# EAGLE design AnalogOutputModule_8ch (EAGLE 7.7.0)
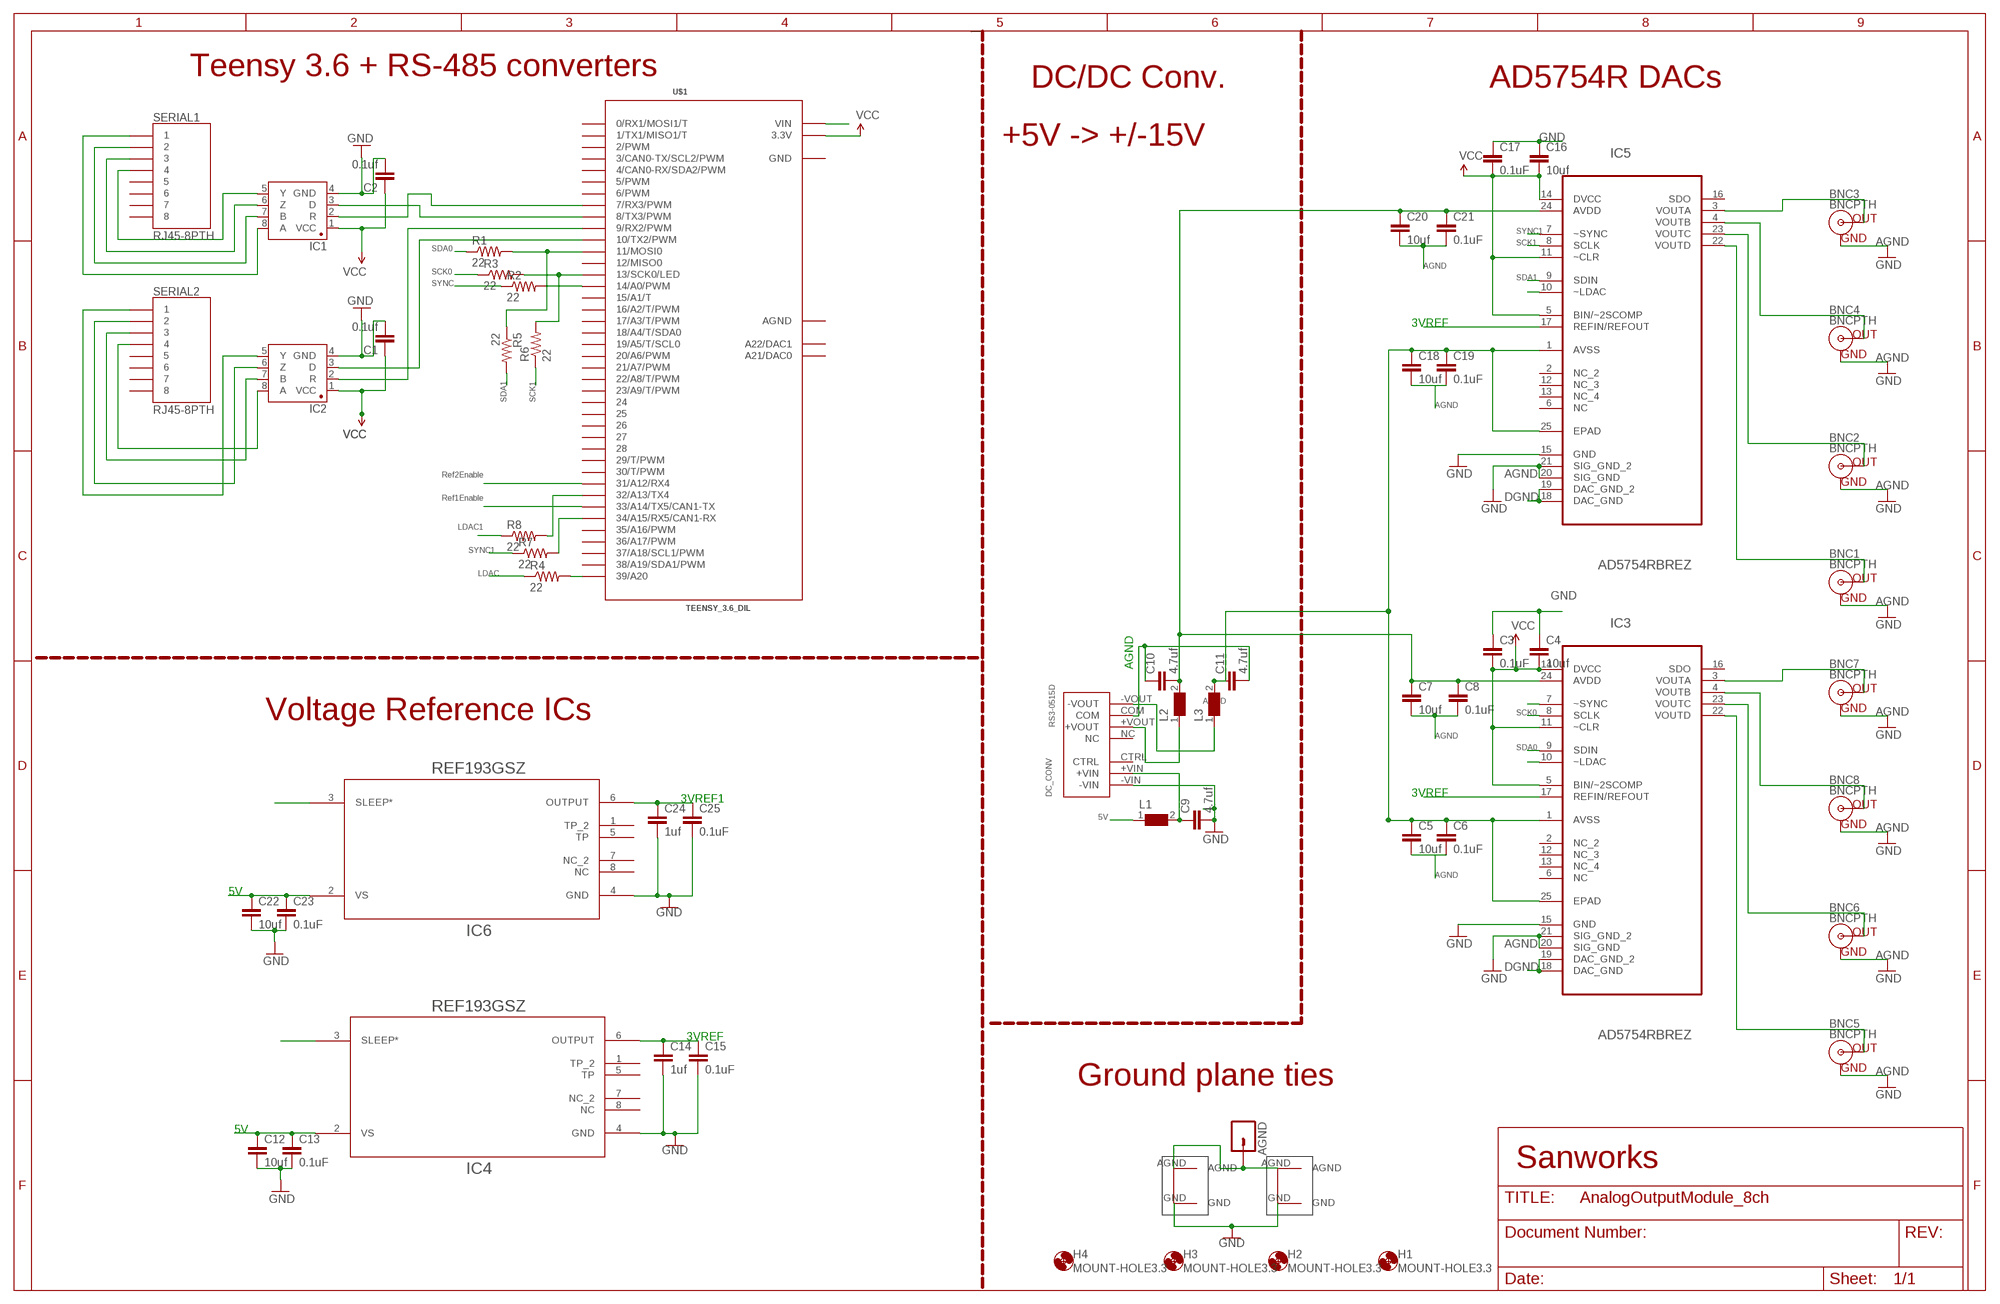
[diagram p0: schematic, sheet 1]

## Parts
AGND  M01PTH  [1X01]
BNC1  BNCPTH  [BNC]
BNC2  BNCPTH  [BNC]
BNC3  BNCPTH  [BNC]
BNC4  BNCPTH  [BNC]
BNC5  BNCPTH  [BNC]
BNC6  BNCPTH  [BNC]
BNC7  BNCPTH  [BNC]
BNC8  BNCPTH  [BNC]
C1  0.1uf  CAP1206  [1206@1]
C2  0.1uf  CAP1206  [1206@1]
C3  0.1uF  1.0UF-0805-25V-10%  [0805]
C4  10uf  CAP1206  [1206@1]
C5  10uf  CAP1206  [1206@1]
C6  0.1uF  1.0UF-0805-25V-10%  [0805]
C7  10uf  CAP1206  [1206@1]
C8  0.1uF  1.0UF-0805-25V-10%  [0805]
C9  4.7uf  CAP1206  [1206@1]
C10  4.7uf  CAP1206  [1206@1]
C11  4.7uf  CAP1206  [1206@1]
C12  10uf  CAP1206  [1206@1]
C13  0.1uF  1.0UF-0805-25V-10%  [0805]
C14  1uf  CAP1206  [1206@1]
C15  0.1uF  1.0UF-0805-25V-10%  [0805]
C16  10uf  CAP1206  [1206@1]
C17  0.1uF  1.0UF-0805-25V-10%  [0805]
C18  10uf  CAP1206  [1206@1]
C19  0.1uF  1.0UF-0805-25V-10%  [0805]
C20  10uf  CAP1206  [1206@1]
C21  0.1uF  1.0UF-0805-25V-10%  [0805]
C22  10uf  CAP1206  [1206@1]
C23  0.1uF  1.0UF-0805-25V-10%  [0805]
C24  1uf  CAP1206  [1206@1]
C25  0.1uF  1.0UF-0805-25V-10%  [0805]
DC_CONV  RS3-0515D  [RS3-0515D]
H1  MOUNT-HOLE3.3  [3,3]
H2  MOUNT-HOLE3.3  [3,3]
H3  MOUNT-HOLE3.3  [3,3]
H4  MOUNT-HOLE3.3  [3,3]
IC1  SN65HVD31DR  [SO08]
IC2  SN65HVD31DR  [SO08]
IC3  AD5754RBREZ  [SOP65P640X120-25N]
IC4  REF193GSZ  [R_8]
IC5  AD5754RBREZ  [SOP65P640X120-25N]
IC6  REF193GSZ  [R_8]
L1  WE-CBF-742792118_1206  [1206]
L2  WE-CBF-742792118_1206  [1206]
L3  WE-CBF-742792118_1206  [1206]
R1  22  RESISTOR1206  [1206]
R2  22  RESISTOR1206  [1206]
R3  22  RESISTOR1206  [1206]
R4  22  RESISTOR1206  [1206]
R5  22  RESISTOR1206  [1206]
R6  22  RESISTOR1206  [1206]
R7  22  RESISTOR1206  [1206]
R8  22  RESISTOR1206  [1206]
SERIAL1  RJ45-8PTH  [RJ45-8]
SERIAL2  RJ45-8PTH  [RJ45-8]
U$1  TEENSY_3.6_DIL  [TEENSY_3.6_DIL]
U$2  GNDPLANESHRT  [GNDPLANESHRT]
U$6  GNDPLANESHRT  [GNDPLANESHRT]

## Nets
3VREF: C14.1 C15.1 IC3.17(REFIN/REFOUT) IC4.6(OUTPUT)
3VREF1: C24.1 C25.1 IC5.17(REFIN/REFOUT) IC6.6(OUTPUT)
5V: C3.2 C4.2 C12.1 C13.1 C16.2 C17.2 C22.1 C23.1 IC3.5(BIN/~2SCOMP) IC3.11(~CLR) IC3.14(DVCC) IC4.2(VS) IC5.5(BIN/~2SCOMP) IC5.11(~CLR) IC5.14(DVCC) IC6.2(VS) L1.1 U$1.VIN ; supply symbol labelled VCC
AGND: AGND.1 BNC1.GND BNC2.GND BNC3.GND BNC4.GND BNC5.GND BNC6.GND BNC7.GND BNC8.GND C5.2 C6.2 C7.2 C8.2 C10.1 C11.2 C18.2 C19.2 C20.2 C21.2 DC_CONV.COM IC3.18(DAC_GND) IC3.19(DAC_GND_2) IC3.20(SIG_GND) IC3.21(SIG_GND_2) IC5.18(DAC_GND) IC5.19(DAC_GND_2) IC5.20(SIG_GND) IC5.21(SIG_GND_2) U$2.AGND U$6.AGND ; supply symbol labelled GND
GND: C1.2 C2.2 C3.1 C4.1 C9.2 C12.2 C13.2 C14.2 C15.2 C16.1 C17.1 C22.2 C23.2 C24.2 C25.2 DC_CONV.-VIN IC1.4(GND) IC2.4(GND) IC3.15(GND) IC4.4(GND) IC5.15(GND) IC6.4(GND) U$2.GND U$6.GND
LDAC: IC3.10(~LDAC) R4.1
LDAC1: IC5.10(~LDAC) R8.1
N$1: IC1.3(D) U$1.8(8/TX3/PWM)
N$2: IC1.2(R) U$1.7(7/RX3/PWM)
N$3: IC2.8(A) SERIAL2.4
N$4: IC2.7(B) SERIAL2.3
N$5: IC2.6(Z) SERIAL2.2
N$6: IC2.5(Y) SERIAL2.1
N$7: IC2.3(D) U$1.10(10/TX2/PWM)
N$8: IC2.2(R) U$1.9(9/RX2/PWM)
N$9: BNC7.S(OUT) IC3.3(VOUTA)
N$10: BNC8.S(OUT) IC3.4(VOUTB)
N$11: BNC6.S(OUT) IC3.23(VOUTC)
N$12: BNC5.S(OUT) IC3.22(VOUTD)
N$13: R1.2 R5.1 U$1.11(11/MOSI0)
N$14: R3.2 R6.2 U$1.13(13/SCK0/LED)
N$15: DC_CONV.-VOUT L3.1
N$16: DC_CONV.+VOUT L2.1
N$17: R2.2 U$1.14/A0(14/A0/PWM)
N$18: R4.2 U$1.39/A20
N$19: IC1.8(A) SERIAL1.1
N$21: IC1.7(B) SERIAL1.2
N$22: IC1.6(Z) SERIAL1.3
N$23: IC1.5(Y) SERIAL1.4
N$24: BNC3.S(OUT) IC5.3(VOUTA)
N$25: BNC4.S(OUT) IC5.4(VOUTB)
N$26: BNC2.S(OUT) IC5.23(VOUTC)
N$27: BNC1.S(OUT) IC5.22(VOUTD)
N$28: R7.2 U$1.34/A15(34/A15/RX5/CAN1-RX)
N$30: R8.2 U$1.32/A13(32/A13/TX4)
N$41: C9.1 DC_CONV.+VIN L1.2
REF1ENABLE: IC4.3(SLEEP*) U$1.33/A14(33/A14/TX5/CAN1-TX)
REF2ENABLE: IC6.3(SLEEP*) U$1.31/A12(31/A12/RX4)
SCK0: IC3.8(SCLK) R3.1
SCK1: IC5.8(SCLK) R6.1
SDA0: IC3.9(SDIN) R1.1
SDA1: IC5.9(SDIN) R5.2
SYNC: IC3.7(~SYNC) R2.1
SYNC1: IC5.7(~SYNC) R7.1
VCC: C1.1 C2.1 IC1.1(VCC) IC2.1(VCC) U$1.3.3V U$1.3.3V3(3.3V)
VDD1: C7.1 C8.1 C10.2 C20.1 C21.1 IC3.24(AVDD) IC5.24(AVDD) L2.2
VSS1: C5.1 C6.1 C11.1 C18.1 C19.1 IC3.1(AVSS) IC3.25(EPAD) IC5.1(AVSS) IC5.25(EPAD) L3.2
Unconnected: DC_CONV.CTRL DC_CONV.NC IC3.2(NC_2) IC3.6(NC) IC3.12(NC_3) IC3.13(NC_4) IC3.16(SDO) IC4.1(TP_2) IC4.5(TP) IC4.7(NC_2) IC4.8(NC) IC5.2(NC_2) IC5.6(NC) IC5.12(NC_3) IC5.13(NC_4) IC5.16(SDO) IC6.1(TP_2) IC6.5(TP) IC6.7(NC_2) IC6.8(NC) SERIAL1.5 SERIAL1.6 SERIAL1.7 SERIAL1.8 SERIAL2.5 SERIAL2.6 SERIAL2.7 SERIAL2.8 U$1.0(0/RX1/MOSI1/T) U$1.1(1/TX1/MISO1/T) U$1.2(2/PWM) U$1.3(3/CAN0-TX/SCL2/PWM) U$1.4(4/CAN0-RX/SDA2/PWM) U$1.5(5/PWM) U$1.6(6/PWM) U$1.12(12/MISO0) U$1.15/A1(15/A1/T) U$1.16/A2(16/A2/T/PWM) U$1.17/A3(17/A3/T/PWM) U$1.18/A4(18/A4/T/SDA0) U$1.19/A5(19/A5/T/SCL0) U$1.20/A6(20/A6/PWM) U$1.21/A7(21/A7/PWM) U$1.22/A8(22/A8/T/PWM) U$1.23/A9(23/A9/T/PWM) U$1.24 U$1.25 U$1.26 U$1.27 U$1.28 U$1.29(29/T/PWM) U$1.30(30/T/PWM) U$1.35/A16(35/A16/PWM) U$1.36/A17(36/A17/PWM) U$1.37/A18(37/A18/SCL1/PWM) U$1.38/A19(38/A19/SDA1/PWM) U$1.A21(A21/DAC0) U$1.A22(A22/DAC1)

## Notes on the sheet
- Teensy 3.6 + RS-485 converters
- DC/DC Conv. | AD5754R DACs
- GND
- +5V -> +/-15V
- SYNC1
- SCK1 | AGND
- SDA0
- AGND
- SCK0
- SDA1
- SYNC
- 3VREF
- AGND
- SDA1 | SCK1
- AGND
- Ref2Enable
- AGND
- AGND
- Ref1Enable
- DGND
- LDAC1
- SYNC1
- LDAC
- GND
- AGND
- AGND
- AGND
- SCK0 | AGND
- Voltage Reference ICs
- AGND
- SDA0
- 3VREF
- 3VREF1
- 5V
- AGND
- AGND
- 5V
- AGND
- AGND
- DGND
- 3VREF
- AGND
- Ground plane ties
- 5V
- Sanworks

## Power pins joined to a net without a drawn wire
AGND: U$1.AGND
GND: U$1.GND U$1.GND1(GND)

## Library data of the parts
AGND = SparkFun-Connectors:M01: Header 1 Standard 1-pin 0.1" header. Use with straight break away headers (SKU : PRT-00116), right angle break away headers (PRT-00553), swiss pins (PRT-00743), machine pins (PRT-00117), and female headers (PRT-00115).
BNC1-BNC8 = SparkFun-Connectors:BNC: BNC Right Angle Connector Mouser Part# 5227161 SparkFun Products: BNC Connector - Right Angle <https://www.sparkfun.com/products/10550>; PROD_ID: LPA-12729; SF_ID: PRT-10550
C1 C2 C4 C5 C7 C9-C12 C14 C16 C18 C20 C22 C24 = SparkFun-Capacitors:CAP: Capacitor Standard 0603 ceramic capacitor, and 0.1" leaded capacitor.
C3 C6 C8 C13 C15 C17 C19 C21 C23 C25 = SparkFun-Capacitors:1.0UF: 1µF ceramic capacitors A capacitor is a passive two-terminal electrical component used to store electrical energy temporarily in an electric field.; PROD_ID: CAP-08064; VALUE: 1.0uF
DC_CONV = JoshParts10:RS3-0515D
H1-H4 = holes:MOUNT-HOLE: MOUNTING HOLE with drill center marker
IC1 IC2 = Joshparts4:SN65HVD31DR: A placeholder for generic narrow & wide SOIC8 foorptints - used on the DIP adapter board.
IC3 IC5 = Analog Devices_By_element14_Batch_1:AD5754RBREZ: DAC; MPN: AD5754RBREZ; OC_FARNELL: 1786050; OC_NEWARK: 51P3755; PACKAGE: TSSOP-24; SUPPLIER: Analog Devices
IC4 IC6 = REF193:REF193GSZ; MANUFACTURER_PART_NUMBER: REF193GSZ; VENDOR: Vendor
L1-L3 = WE-CBF:WE-CBF: SMD EMI Suppression Ferrite Beads WE-CBF - Excellent anti-EMI properties - Low DC-restistance - Impedances till 3000 ohms - Rated current up to 6 A -- Reliable Ni-Sn electrodes -- Perfect as data lined filter and for uncoupling of distribution voltage; MPN: 742792118; OC_FARNELL: 1800374; OC_NEWARK: 78R5648; PACKAGE: IND-1206; SUPPLIER: Wuerth Elektronik
R1-R8 = SparkFun-Resistors:RESISTOR: Resistor Basic schematic elements and footprints for 0603, 1206, and PTH resistors.
SERIAL1 SERIAL2 = SparkFun:RJ45-8: RJ45 Jack Simple RJ45, 8-pin connection - connector for common Cat5, Cat5e, and Cat6 Ethernet cables. Footprint not yet proven in production. Connector sku is PRT-00643; Breakout PCB sku is BOB-00716.
U$1 = Teensy_3_and_LC_Series_Boards_v1.4:TEENSY_3.6_DIL: Teensy 3.6 DIL Package
U$2 U$6 = Joshparts2:GNDPLANESHRT

## Net classes
0 default: width 0.203 mm

## Board
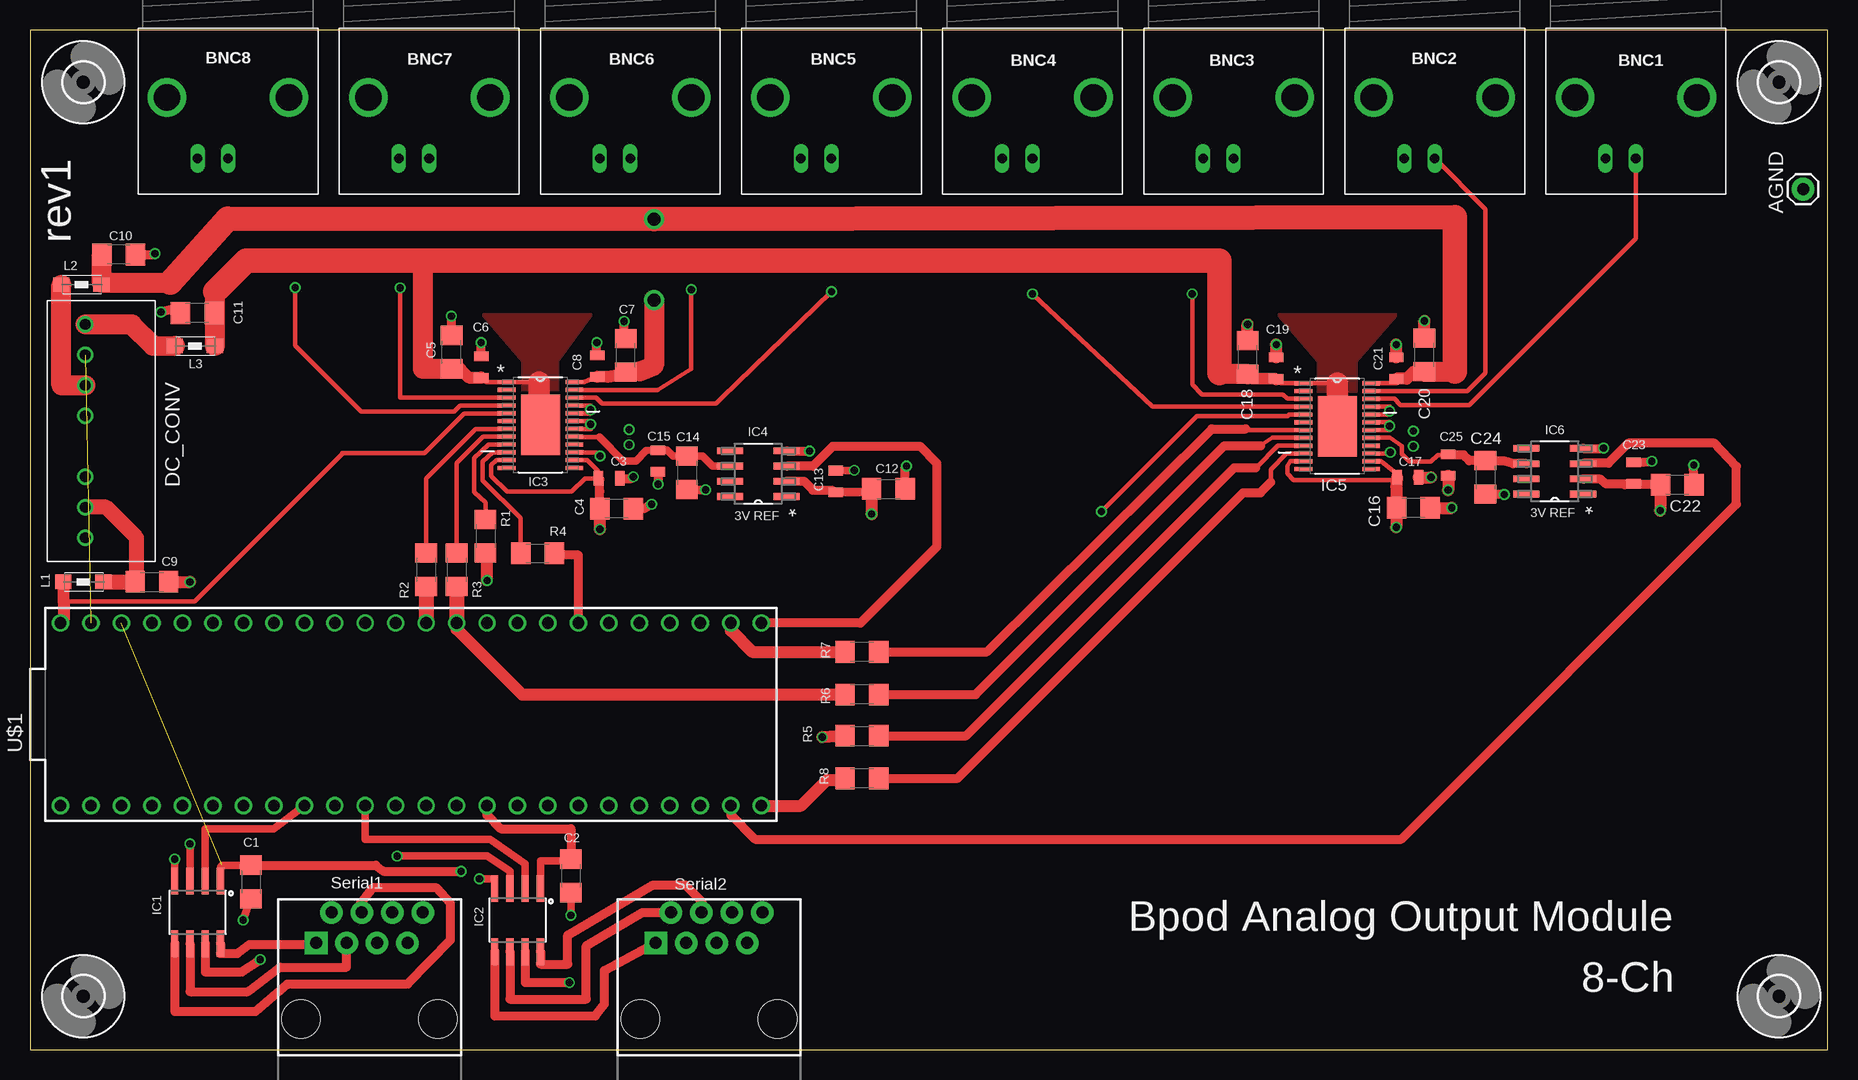
[diagram p1: board, top side]
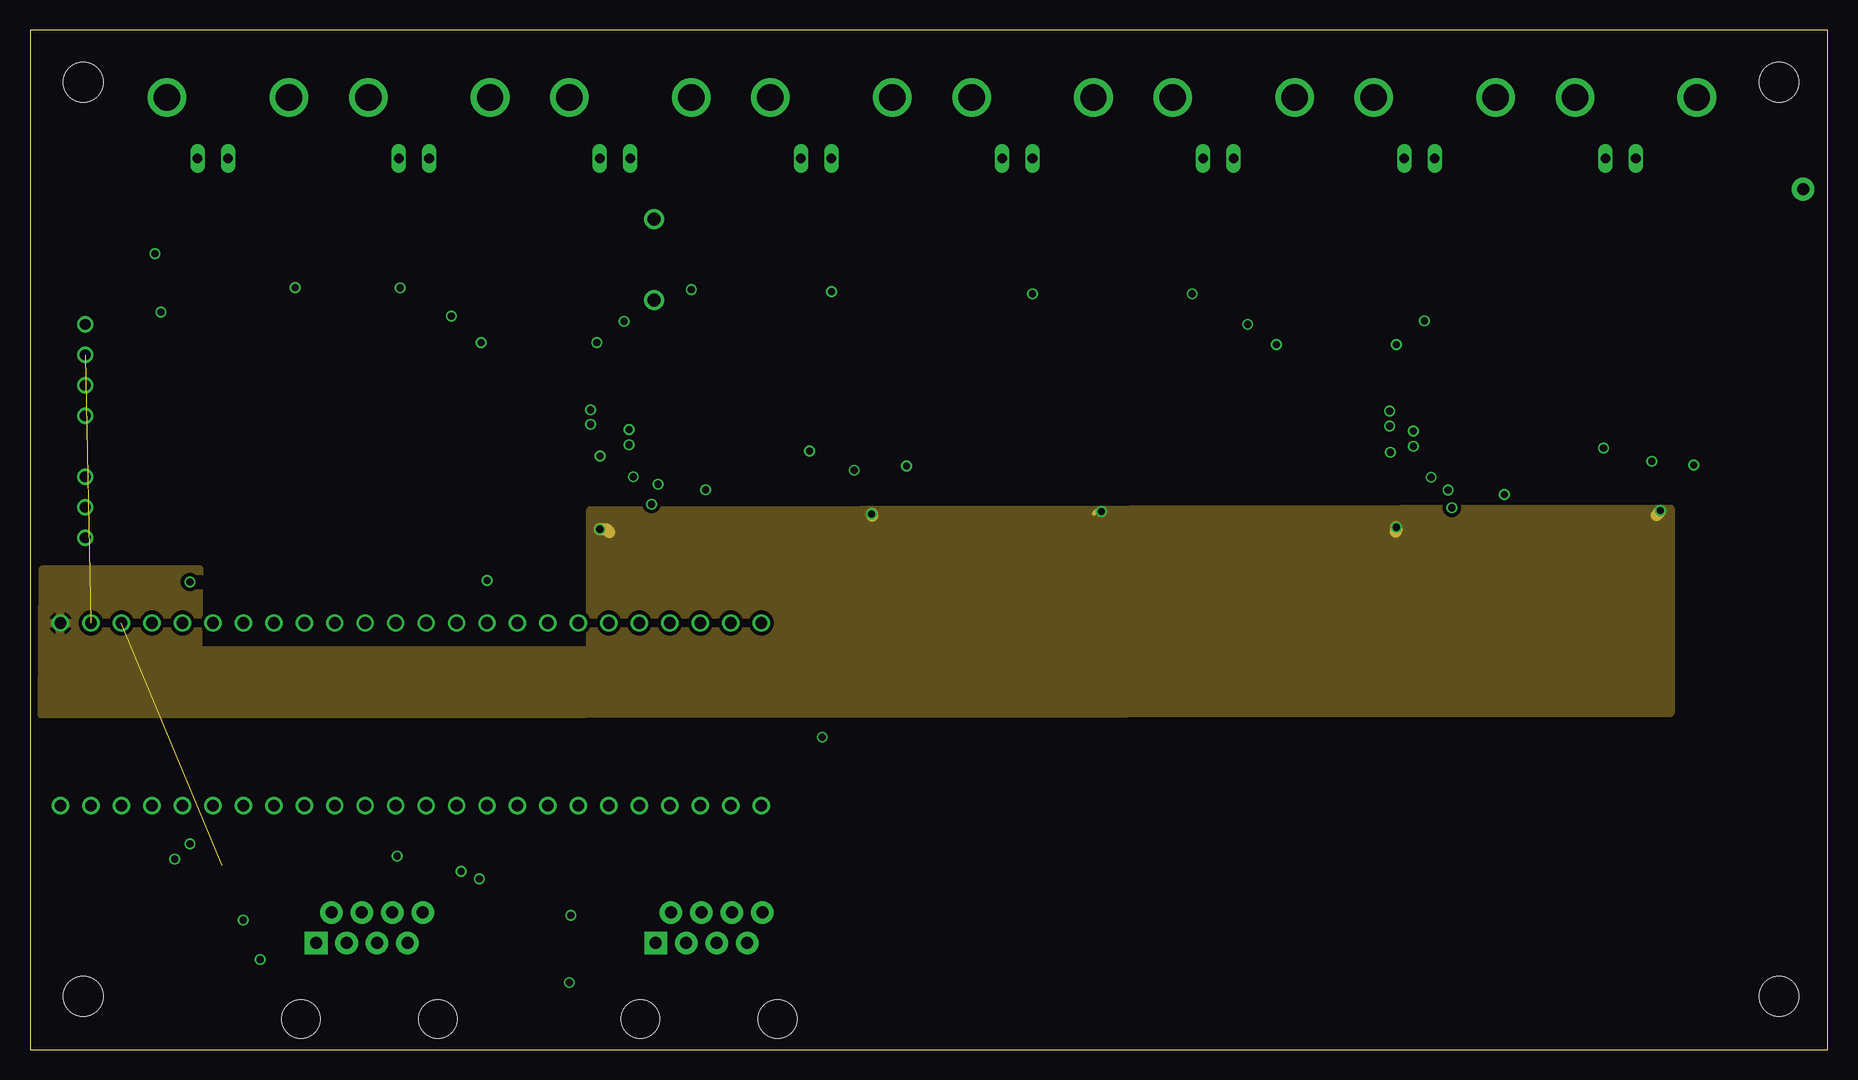
[diagram p2: board, inner layer Route2]
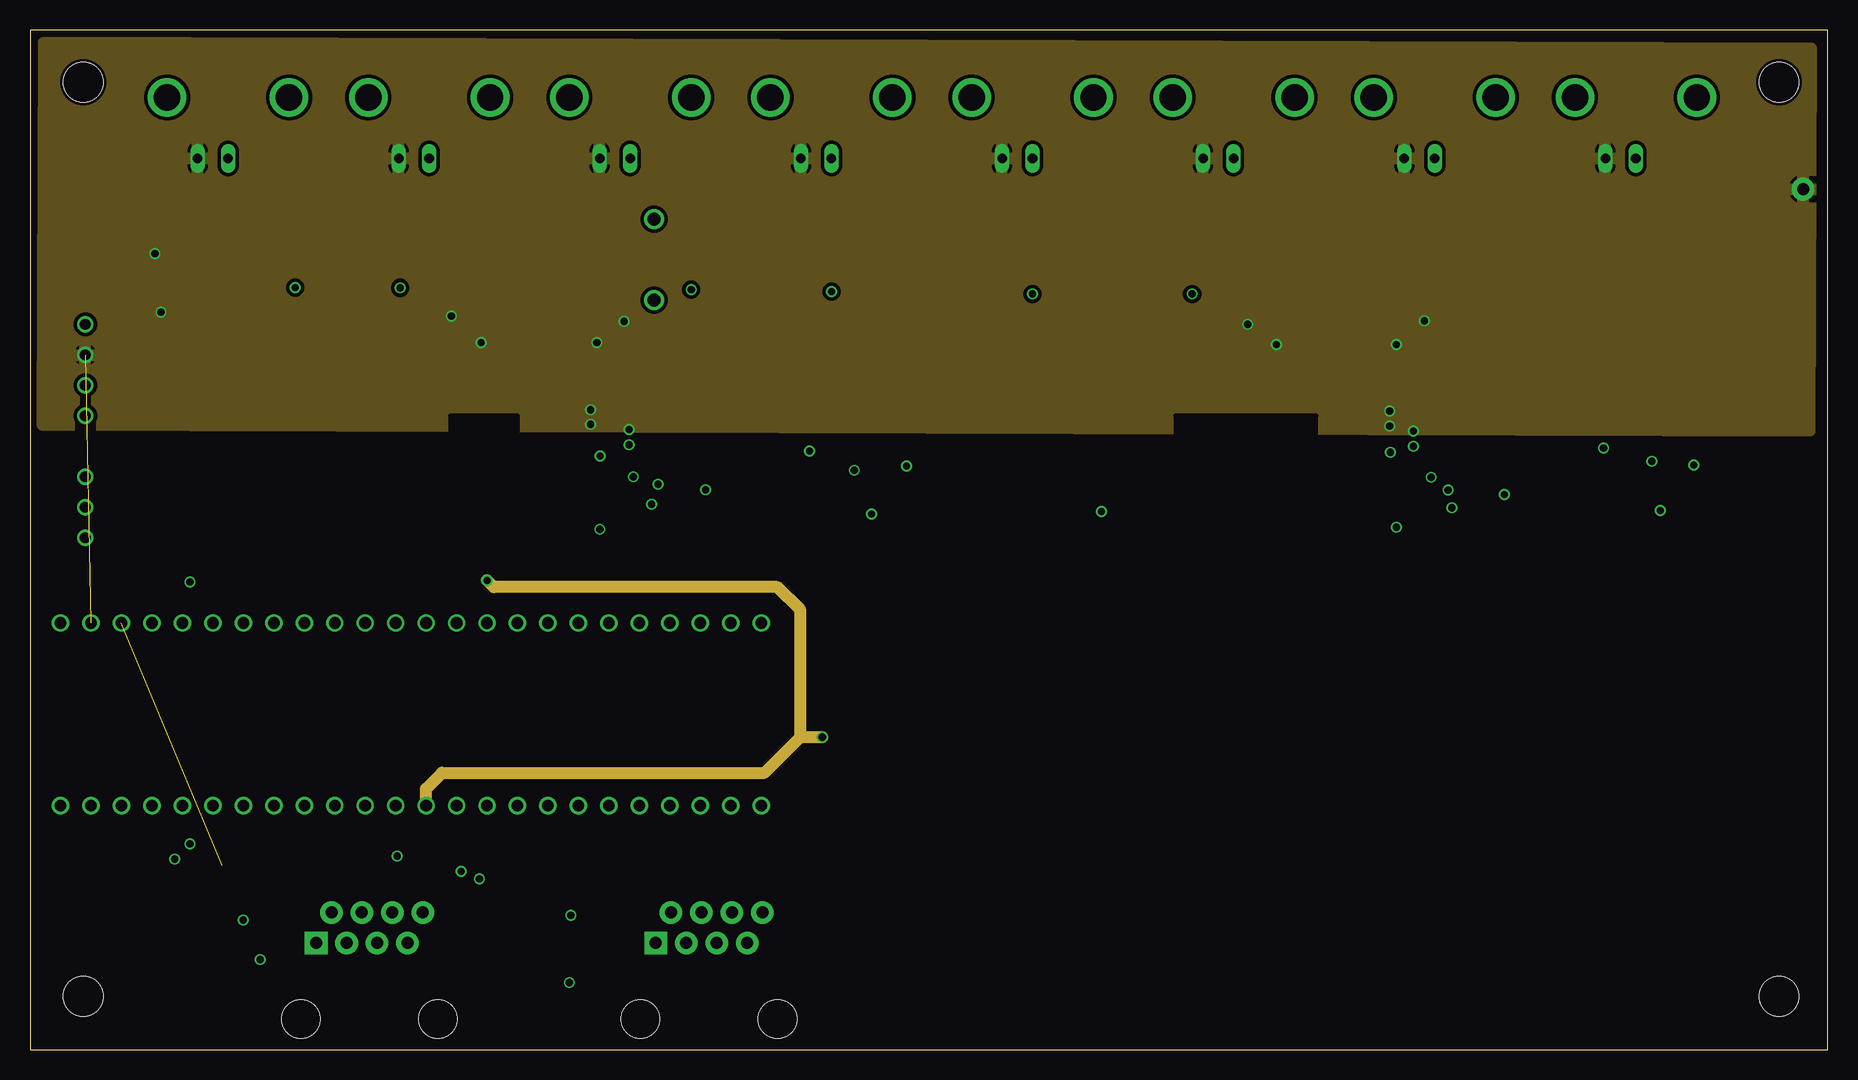
[diagram p3: board, inner layer Route15]
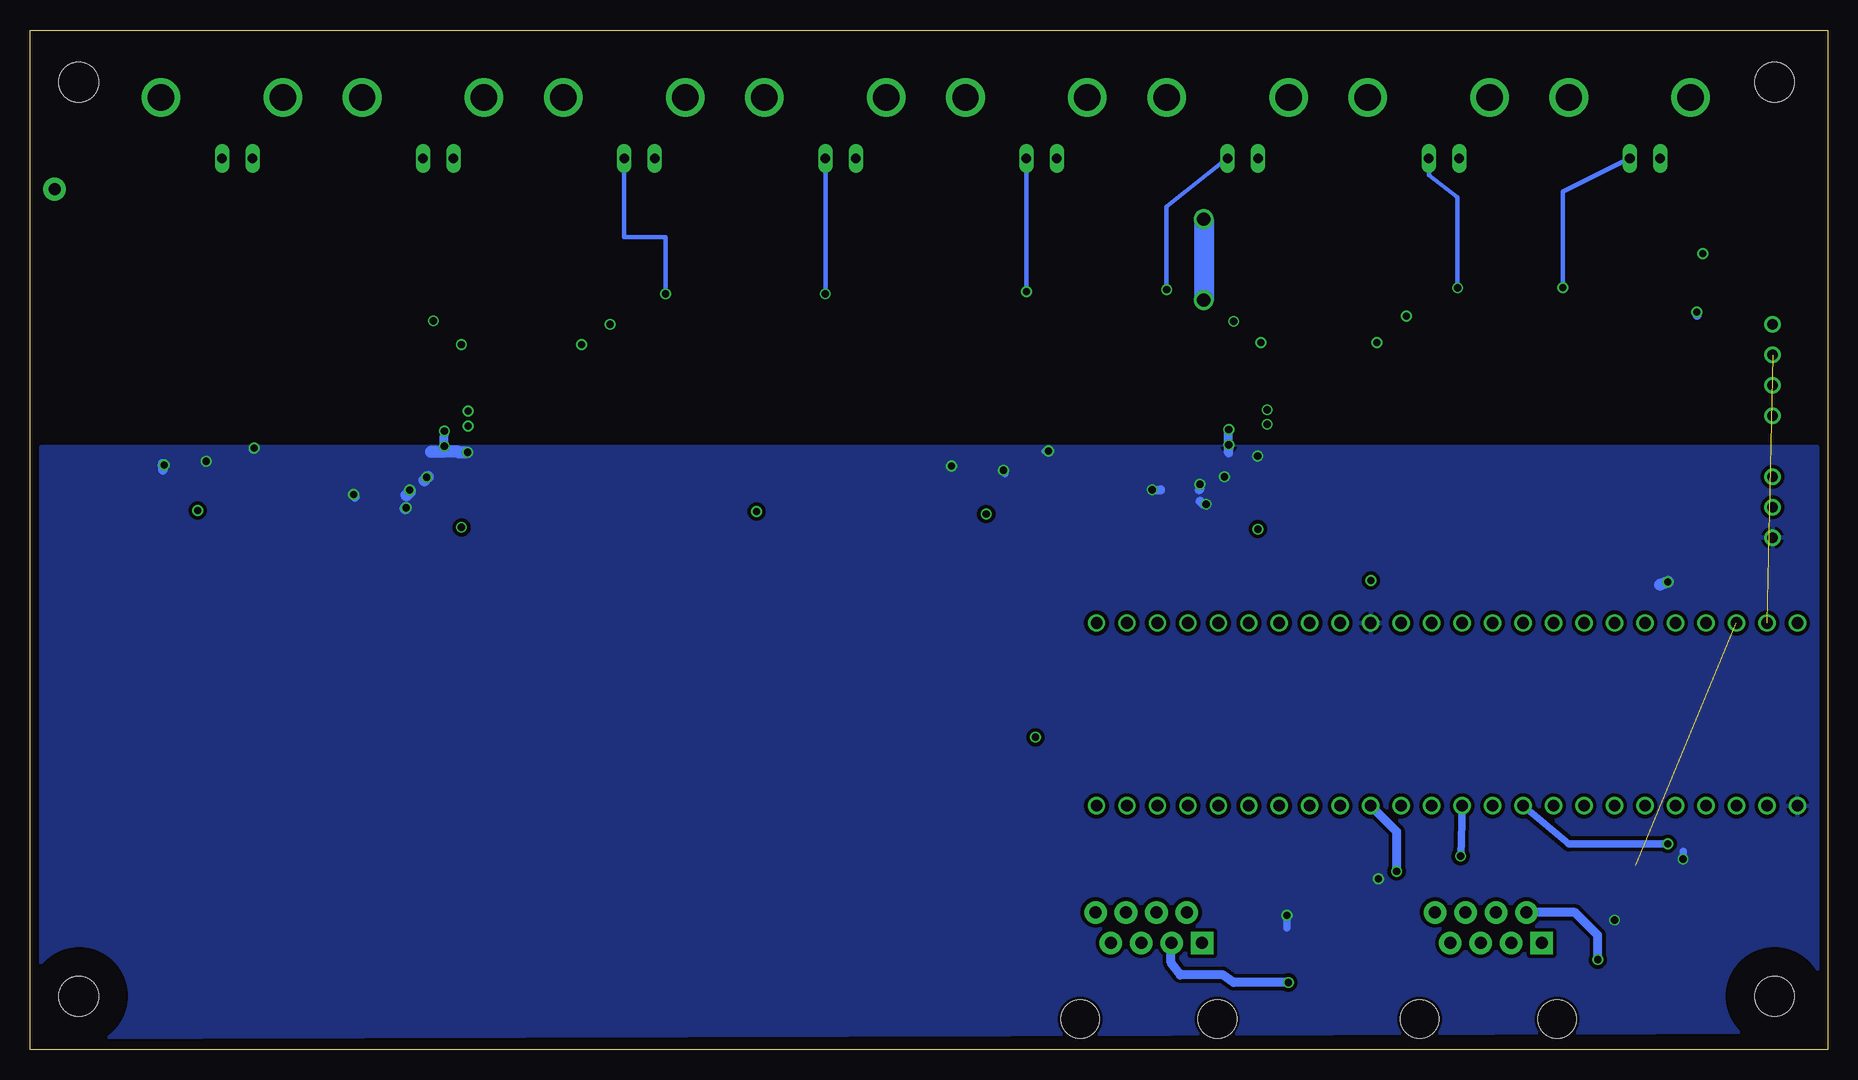
[diagram p4: board, bottom side, seen from below]

Size 149.86 x 85 mm. Coordinates in mm from the lower left corner, seen from the top.
Outline: 0,0 149.86,0 149.86,85 0,85 0,0
Copper layers (1*2*15*16): Top 0.035mm / dielectric 0.2mm / Route2 0.0175mm / dielectric 0.3mm / Route15 0.0175mm / dielectric 0.2mm / Bottom 0.035mm
Design rules "SeeedStudio_4layer_DRU_no_angle_20140221 *": minimum track width 8mil, minimum drill 12mil, track to track 12mil, track to pad 12mil, pad to pad 12mil, via to via 12mil, smd to smd 0mil, copper to edge 10mil, drill to drill 8mil, minimum pad ring 6mil, minimum via ring 4mil, stop-mask expansion 4mil, vias tented up to drill 25mil, thermal gap 10mil
tRestrict: area 3.8,37.6 to 11.4,40.6; area 3.6,33.8 to 14.5,37.3

### Footprints (pad centres in the part's own frame; a part is rotated, then mirrored left to right if it is on the bottom)
1X01 = drill 1.016 pad 1.88: 1 0,0
BNC = drill 2.2: 3 -5.08,5.08; 4 5.08,5.08 | drill 0.8 long: GND -2.54,0; S 0,0
1206@1 = smd 1.6 x 1.8: 1 -1.4,0; 2 1.4,0
0805 = smd 0.8 x 1.2: 1 -0.9,0; 2 0.9,0
RS3-0515D = drill 0.9: +VIN 7.62,5.08; +VOUT 17.78,5.08; -VIN 5.08,5.08; -VOUT 22.86,5.08; COM 20.32,5.08; CTRL 10.16,5.08; NC 15.24,5.08
3,3 = hole 3.3: 0,0
SO08 = smd 0.61 x 2.21: 1 -1.905,-2.616; 2 -0.635,-2.616; 3 0.635,-2.616; 4 1.905,-2.616; 5 1.905,2.616; 6 0.635,2.616; 7 -0.635,2.616; 8 -1.905,2.616
SOP65P640X120-25N = smd 1.473 x 0.356: 1 -2.819,3.581; 2 -2.819,2.921; 3 -2.819,2.286; 4 -2.819,1.626; 5 -2.819,0.965; 6 -2.819,0.33; 7 -2.819,-0.33; 8 -2.819,-0.965; 9 -2.819,-1.626; 10 -2.819,-2.286; 11 -2.819,-2.921; 12 -2.819,-3.581; 13 2.819,-3.581; 14 2.819,-2.921; 15 2.819,-2.286; 16 2.819,-1.626; 17 2.819,-0.965; 18 2.819,-0.33; 19 2.819,0.33; 20 2.819,0.965; 21 2.819,1.626; 22 2.819,2.286; 23 2.819,2.921; 24 2.819,3.581 | smd 3.251 x 5.029: 25 0,0
R_8 = smd 2.184 x 0.559: 1 -2.362,1.905; 2 -2.362,0.635; 3 -2.362,-0.635; 4 -2.362,-1.905; 5 2.362,-1.905; 6 2.362,-0.635; 7 2.362,0.635; 8 2.362,1.905
1206 = smd 1.35 x 1.2: 1 -1.675,0; 2 1.675,0
1206' = smd 1.6 x 1.8: 1 -1.4,0; 2 1.4,0
RJ45-8 = drill 1 pad 1.88 square: 1 -4.445,6.35 | drill 1 pad 1.88: 2 -3.175,8.89; 3 -1.905,6.35; 4 -0.635,8.89; 5 0.635,6.35; 6 1.905,8.89; 7 3.175,6.35; 8 4.445,8.89 | hole 3.2: -5.715,0; 5.715,0
TEENSY_3.6_DIL = drill 0.965: 0 -7.62,25.4; 1 -7.62,22.86; 2 -7.62,20.32; 3 -7.62,17.78; 3.3V 7.62,22.86; 3.3V3 -7.62,-7.62; 4 -7.62,15.24; 5 -7.62,12.7; 6 -7.62,10.16; 7 -7.62,7.62; 8 -7.62,5.08; 9 -7.62,2.54; 10 -7.62,0; 11 -7.62,-2.54; 12 -7.62,-5.08; 13 7.62,-5.08; 14/A0 7.62,-2.54; 15/A1 7.62,0; 16/A2 7.62,2.54; 17/A3 7.62,5.08; 18/A4 7.62,7.62; 19/A5 7.62,10.16; 20/A6 7.62,12.7; 21/A7 7.62,15.24; 22/A8 7.62,17.78; 23/A9 7.62,20.32; 24 -7.62,-10.16; 25 -7.62,-12.7; 26 -7.62,-15.24; 27 -7.62,-17.78; 28 -7.62,-20.32; 29 -7.62,-22.86; 30 -7.62,-25.4; 31/A12 -7.62,-27.94; 32/A13 -7.62,-30.48; 33/A14 7.62,-30.48; 34/A15 7.62,-27.94; 35/A16 7.62,-25.4; 36/A17 7.62,-22.86; 37/A18 7.62,-20.32; 38/A19 7.62,-17.78; 39/A20 7.62,-15.24; A21 7.62,-12.7; A22 7.62,-10.16; AGND 7.62,25.4; GND -7.62,27.94; GND1 7.62,-7.62; VIN 7.62,27.94
GNDPLANESHRT = drill 0.6: AGND -1.27,0; GND 0,0

### Placement (x,y rotation side)
AGND  147.8,71.73 0 top
BNC1  133.86,74.3 0 top
BNC2  117.09,74.3 0 top
BNC3  100.33,74.3 0 top
BNC4  83.57,74.3 0 top
BNC5  66.8,74.3 0 top
BNC6  50.04,74.3 0 top
BNC7  33.27,74.3 0 top
BNC8  16.51,74.3 0 top
C1  18.41,13.97 270 top
C2  45.09,14.48 270 top
C3  48.26,47.62 180 top
C4  48.9,45.09 180 top
C5  35.15,58.15 90 top
C6  37.62,56.91 90 top
C7  49.66,57.88 90 top
C8  47.27,56.99 90 top
C9  10.16,38.99 0 top
C10  7.4,66.27 180 top
C11  13.94,61.39 180 top
C12  71.55,46.74 0 top
C13  67.16,47.37 90 top
C14  54.76,48.08 270 top
C15  52.35,49.07 270 top
C16  115.32,45.16 180 top
C17  114.86,47.7 180 top
C18  101.5,57.71 90 top
C19  103.89,56.79 90 top
C20  116.23,57.91 90 top
C21  113.89,56.79 90 top
C22  137.31,47.09 0 top
C23  133.68,48.06 90 top
C24  121.31,47.7 270 top
C25  118.21,48.72 270 top
DC_CONV  9.69,37.59 90 top
H1  145.8,4.45 0 top
H2  4.45,4.45 0 top
H3  4.45,80.64 0 top
H4  145.8,80.64 0 top
IC1  13.97,11.43 180 top
IC2  40.64,10.79 180 top
IC3  42.55,52.07 0 top
IC4  60.71,48.01 180 top
IC5  108.97,51.97 0 top
IC6  127.1,48.21 180 top
L1  4.45,38.99 0 top
L2  4.29,63.77 0 top
L3  13.74,58.65 0 top
R1  22  [1206']  37.97,42.8 270 top
R2  22  [1206']  33.02,40.01 270 top
R3  22  [1206']  35.56,40.01 270 top
R4  22  [1206']  42.32,41.38 0 top
R5  22  [1206']  69.34,26.16 0 top
R6  22  [1206']  69.34,29.59 180 top
R7  22  [1206']  69.34,33.15 180 top
R8  22  [1206']  69.34,22.61 180 top
SERIAL1  28.3,2.54 0 top
SERIAL2  56.6,2.54 0 top
U$1  30.48,27.94 90 top
U$2  115.32,50.29 270 top
U$6  49.94,50.42 270 top

### Tracks (layer width: path | path; a pad name or v marks a point on that pad's centre or on a via)
3VREF
  Top 0.381: 47.47,51.08 45.41,51.08 IC3.17
  Top 0.635: IC4.6 56.9,48.64 56.06,49.48 C14.1 53.59,49.48 53.11,49.96 52.39,49.96 C15.1 51.37,49.92 50.52,49.07 49.45,49.07 47.47,51.08
3VREF1
  Top 0.381: IC5.17 113.33,51 114.35,50.29 114.35,49.63 114.96,49.02 116.79,49.02 117.35,49.58 118.2,49.58 C25.1
  Top 0.762: IC6.6 123.62,48.84 122.89,49.07 121.34,49.07 C24.1 119.96,49.1 119.48,49.58 118.22,49.58 C25.1
5V  (via drill 0.6)
  Top 0.381: IC3.14 46.43,49.15 47.4,48.18 47.4,47.64 C3.2 | 47.16,47.37 C3.2 | IC3.5 36.2,53.03 32.89,49.73 26.04,49.73 26.04,49.66 13.72,37.34 2.79,37.34 | IC3.11 38.91,49.15 38.46,48.74 38.46,47.83 39.78,46.51 45.16,46.51 46.28,47.62 C3.2 | 47.47,46.51 47.49,46.53 | IC5.14 112.6,49.05 113.89,48.01 113.89,47.16 C17.2 113.81,47.5 105.31,47.5 104.8,48.01 104.8,48.67 105.08,49.05 IC5.11 | IC5.5 104.95,52.93 104.85,52.83 97.28,52.83 v89.31,44.86
  Top 0.635: 63.08,47.38 IC4.2
  Top 0.762: C4.2 47.49,46.53 47.49,47.54 C3.2 | 63.08,47.38 64.5,47.38 65.25,46.63 66.84,46.63 C13.1 69.94,46.52 C12.1 | 70.15,44.6 70.16,44.6 | IC6.2 129.49,47.55 130.91,47.55 131.35,47.16 132.32,47.16 C23.1 132.91,47.09 C22.1
  Top 1.016: C17.2 113.92,46.78 C16.2 113.92,43.71 v113.89,43.54 | L1.1 2.79,38.97 2.79,37.34 2.79,35.81 U$1.VIN | C12.1 70.15,44.71 | C4.2 v47.49,43.39 v47.5,43.38 | 70.15,44.6 70.15,44.71 | 70.15,44.71 v70.16,44.65 | C22.1 135.91,45.08 v135.89,44.93
  Route2 0.381: v89.31,44.86 88.85,44.86 88.7,44.7
  Route2 1.016: v70.16,44.65 70.21,44.5 | v47.5,43.38 48.06,43.38 48.31,43.13 | v135.89,44.93 135.64,44.6 135.59,44.55 | v113.89,43.54 113.89,43.23 113.84,43.18
  pour Route2: 1.12,40.03 14.07,40.03 13.97,33.27 46.74,33.27 46.74,44.96 136.73,45.09 136.73,28.07 1.02,27.94
AGND  (via drill 0.6)  (1 unrouted)
  Top 0.381: v46.74,53.34 46.74,53.03 IC3.20 46.71,53.03 46.71,53.7 IC3.21 | IC3.19 46.74,52.4 | IC3.18 46.76,51.74 46.76,52.4 46.74,52.4 | IC5.21 113.33,53.59 v113.33,53.24 113.33,52.93 IC5.20 | IC5.18 113.33,51.64 v113.33,51.97 113.33,52.3 IC5.19 | 46.74,52.4 v46.74,52.12
  Top 0.762: C5.2 35.15,60.36 v35.13,61.14 | C6.2 37.62,58.9 v37.59,58.93 | C8.2 47.24,57.97 v47.24,58.93 | C7.2 49.53,59.05 v49.53,60.71 | C10.1 10.16,66.27 v10.41,66.34 | C11.2 11.61,61.65 v10.92,61.47
  Top 1.016: C18.2 v101.5,60.45 | C19.2 v103.89,58.78 | C20.2 v116.23,60.76 | C21.2 v113.89,58.78
  Route15 0.381: v113.33,51.97 113.39,51.97 | v46.74,52.12 46.79,52.12
  Bottom 0.381: v113.33,53.24 113.33,52.93
  Bottom 0.762: v10.92,61.47 10.92,61.21
  pour Route15: 1.14,83.92 1.04,52.1 148.36,51.61 148.46,83.44
GND  (via drill 0.6)
  Top 0.381: IC3.15 47.22,49.78 v47.52,49.48 | IC5.15 113.28,49.68 v113.39,49.78
  Top 0.508: 64.95,49.91 v64.97,49.89
  Top 0.635: C1.2 v17.78,10.79 | IC1.4 v12.06,15.88 | C2.2 v45.09,11.18 | v37.47,14.22 38.73,14.22 IC2.4 | C13.2 v68.71,48.28
  Top 0.762: C3.1 50.16,47.62 v50.29,47.75 | C4.1 51.18,45.09 v51.82,45.47 | IC4.4 64.95,49.91 | C14.2 55.04,46.68 v56.31,46.66 | C15.2 v52.35,47.12 | C23.2 134.47,48.97 135.18,49.02 v135.18,49.05 | C22.2 138.66,48.64 v138.68,48.72 | IC6.4 131.09,50.11 v131.17,50.14 | C24.2 122.66,46.3 v122.89,46.28 | C12.2 72.95,48.54 v73.05,48.64
  Top 1.016: C9.2 v13.34,38.99 | C16.1 v118.52,45.16 | C25.2 v118.21,46.63 | C17.1 v116.79,47.7
  Bottom 0.381: v47.52,49.48 47.8,49.48 47.83,49.45
  Bottom 0.508: v64.97,49.89 65.3,49.89 65.33,49.86
  Bottom 0.635: v12.06,15.88 12.06,16.51 | v45.09,11.18 45.09,10.16 | v73.05,48.64 73.03,48.49 | v68.71,48.28 68.61,48.01
  Bottom 0.762: v51.82,45.47 52.07,45.47 52.32,45.72 | 49.96,51.71 49.96,49.73 49.94,50.31 U$6.GND | v56.31,46.66 55.63,46.69 | v52.35,47.12 52.35,46.71 52.4,46.66 | v135.18,49.05 135.18,49.02 135.23,48.97 | v138.68,48.72 138.79,48.31 138.84,48.87 | v131.17,50.14 131.27,50.04 131.12,50.14 | v122.89,46.28 122.73,46.08 122.78,46.02 | 115.37,49.89 115.32,51.61
  Bottom 1.016: v13.34,38.99 13.97,38.73 | v118.52,45.16 118.57,45.11 | v118.21,46.63 118.21,46.48 118.47,46.23 | 116.69,47.75 v116.79,47.7 116.99,47.45 | v113.39,49.78 114.15,49.78 114.15,49.84 115.37,49.84 | 116.43,49.84 115.37,49.84 | 115.37,49.84 115.37,49.89
  pour Bottom: 0.89,50.22 0.89,1.47 148.92,1.04 148.92,50.22
LDAC
  Top 0.381: R4.1 40.92,44.33 37.74,47.45 37.74,49.02 38.56,49.78 IC3.10
LDAC1
  Top 0.381: 103.43,47.3 103.43,48.36 104.75,49.68 IC5.10
  Top 0.762: R8.1 77.32,22.61 101.14,46.43 102.56,46.43 103.43,47.3
N$1  (via drill 0.6)
  Top 0.635: IC1.3 v13.34,17.14
  Bottom 0.635: v13.34,17.14 21.59,17.14 U$1.8
N$2
  Top 0.635: IC1.2 14.61,18.41 20.32,18.41 U$1.7
N$3
  Top 0.762: SERIAL2.4 56.01,11.47 56.01,12.32 54.61,13.72 51.94,13.72 44.83,9.53 44.83,7.11 42.55,7.11 IC2.8
N$4  (via drill 0.6)
  Top 0.762: IC2.7 41.27,5.59 v44.96,5.59
  Bottom 0.762: v44.96,5.59 49.53,5.59 50.42,6.22 53.98,6.22 54.74,7.24 54.74,8.85 SERIAL2.3
N$5
  Top 0.762: IC2.6 40.01,4.19 46.35,4.19 46.35,8.64 51.05,11.43 SERIAL2.2
N$6
  Top 0.762: IC2.5 38.73,2.79 47.12,2.79 47.88,3.81 47.88,6.6 SERIAL2.1 52.07,8.8
N$7  (via drill 0.6)
  Top 0.635: IC2.3 40.01,14.86 38.1,16.13 v30.61,16.13
  Bottom 0.635: v30.61,16.13 U$1.10
N$8
  Top 0.635: IC2.2 41.27,15.49 38.35,17.53 27.94,17.53 U$1.9
N$9  (via drill 0.6)
  Top 0.381: IC3.3 30.86,54.36 v30.86,63.5
  Bottom 0.381: v30.86,63.5 30.86,71.04 33.27,72.9 BNC7.S
N$10  (via drill 0.6)
  Top 0.381: v22.1,63.52 22.1,58.67 27.58,53.19 35.36,53.19 35.87,53.7 IC3.4
  Bottom 0.381: BNC8.S 22.1,71.5 v22.1,63.52
N$11  (via drill 0.6)
  Top 0.381: IC3.23 52.3,54.99 55.12,56.74 v55.12,63.35
  Bottom 0.381: v55.12,63.35 55.12,70.28 BNC6.S
N$12  (via drill 0.6)
  Top 0.381: v66.8,63.2 57.66,54.3 57.2,53.85 47.7,53.85 47.19,54.36 IC3.22
  Bottom 0.381: v66.8,63.2 BNC5.S
N$13  (via drill 0.6)
  Top 0.762: 38.1,41.27 R1.2
  Top 1.016: v38.1,39.12 38.1,41.27 | R5.1 v66.04,26.04
  Route15 1.016: U$1.11 33.02,21.74 34.34,23.06 61.21,23.06 64.21,26.06 | 64.21,26.06 64.21,36.63 62.28,38.56 38.66,38.56 v38.1,39.12 | 64.21,26.06 66.02,26.06 v66.04,26.04
N$14
  Top 0.762: U$1.13 35.56,35.31
  Top 1.016: 35.56,35.31 35.56,35.05 41.02,29.59 R6.2
  Top 1.27: R3.2 U$1.13
N$15
  Top 1.676: L3.1 10.27,58.68 8.49,60.45 DC_CONV.-VOUT
N$16
  Top 1.676: DC_CONV.+VOUT 2.61,55.38 L2.1
N$17
  Top 1.27: R2.2 U$1.14/A0
N$18
  Top 0.762: U$1.39/A20 45.72,41.22 44.35,41.22 43.79,41.3 R4.2
N$19
  Top 0.762: IC1.8 15.88,8 17.27,8 18.29,8.76 23.73,8.76 SERIAL1.1
N$20
  cutout Route15: 40.64,51.31 40.64,52.83 35.05,52.83 35.05,51.31
N$21  (via drill 0.6)
  Top 0.762: IC1.7 14.61,6.48 17.65,6.48 v19.18,7.49
  Bottom 0.762: v19.18,7.49 19.18,9.53 21.08,11.43 SERIAL1.2
N$22
  Top 0.762: IC1.6 13.34,4.83 18.16,4.83 20.83,6.86 26.39,6.86 SERIAL1.3
N$23
  Top 0.762: IC1.5 12.06,3.17 18.8,3.17 21.46,5.46 31.5,5.46 35.05,9.14 35.05,12.19 33.91,13.46 28.57,13.46 27.56,12.19 27.56,11.54 SERIAL1.4 27.69,11.45
N$24  (via drill 0.6)
  Top 0.381: IC5.3 104.8,54.25 104.44,54.61 97.69,54.61 96.88,55.42 v96.88,62.99
  Bottom 0.381: v96.88,62.99 96.88,67.72 100.33,67.72 BNC3.S 100.43,74.19
N$25  (via drill 0.6)
  Top 0.381: IC5.4 93.57,53.59 v83.57,62.99
  Bottom 0.381: v83.57,62.99 BNC4.S
N$26
  Top 0.381: IC5.23 119.81,54.89 121.31,56.39 121.31,70.08 BNC2.S
N$27
  Top 0.381: BNC1.S 133.86,67.61 119.99,53.75 114.25,53.75 113.74,54.25 IC5.22
N$28
  Top 1.016: U$1.34/A15 58.42,34.92 60.2,33.15 R7.2
N$29
  cutout Route15: 107.19,50.8 107.19,52.83 95.5,52.83 95.5,50.8
N$30
  Top 1.016: U$1.32/A13 64.26,20.32 66.42,22.48 67.81,22.48 R8.2
N$41
  Top 1.27: C9.1 L1.2 C9.1 8.89,38.86 8.89,42.67 6.35,45.21 DC_CONV.+VIN
REF1ENABLE
  Top 0.762: U$1.33/A14 69.22,35.56 75.56,41.91 75.56,48.9 74.17,50.29 66.93,50.29 65.28,48.64 IC4.3
REF2ENABLE
  Top 0.381: IC6.3 129.51,48.84 129.51,48.9
  Top 0.762: U$1.31/A12 58.42,19.56 60.45,17.53 114.3,17.53 142.24,45.47 142.24,48.62 140.41,50.55 133.22,50.55 131.57,48.9 129.51,48.9
SCK0
  Top 0.381: R3.1 35.56,48.9 37.78,51.12 39.71,51.12 IC3.8
SCK1
  Top 0.381: 102.56,50.34 103.58,51 IC5.8
  Top 0.762: R6.1 78.82,29.59 99.57,50.34 102.56,50.34
SDA0
  Top 0.381: R1.1 37.97,45.59 37.03,46.48 37.03,49.3 38.23,50.44 IC3.9
SDA1
  Top 0.381: 102.16,48.51 102.21,48.51 104.04,50.34 IC5.9
  Top 0.762: R5.2 78.03,26.16 100.38,48.51 102.16,48.51
SYNC
  Top 0.381: IC3.7 37.13,51.74 33.02,47.62 R2.1
SYNC1
  Top 0.381: 101.32,51.74 101.42,51.84 101.65,51.66 106.12,51.66 IC5.7
  Top 0.762: R7.1 79.76,33.15 98.5,51.74 101.32,51.74
VCC  (via drill 0.6)  (1 unrouted)
  Top 0.635: IC2.1 42.55,15.75 44.96,15.75 C2.1 | IC1.1 15.88,15.24 16,15.37 C1.1
  Top 0.762: C2.1 45.09,18.41 39.24,18.41 38.1,19.56 U$1.3.3V3 | C1.1 28.83,15.37 29.46,14.86 v35.94,14.86
  Bottom 0.762: v35.94,14.86 35.94,18.16 U$1.3.3V3
VDD1  (via drill 1.1)
  Top 0.381: IC3.24 46.18,55.65 C8.1 | IC5.24 113.89,55.55 C21.1
  Top 1.016: C7.1 49.7,56.33 49.4,56.29 48.17,56.08 C8.1 | C20.1 115.34,56.51 114.76,55.93 113.91,55.93 C21.1
  Top 1.27: L2.2 6,63.92 | 50.83,56.54 49.78,56.49 C7.1
  Top 1.676: C10.2 6,63.92 11.7,63.92 | v52.02,62.48 52.02,57.02 50.83,56.54 | C20.1 118.77,56.51
  Top 2.032: 11.7,63.92 16.46,69.29 v52.02,69.24 118.77,69.39 118.77,56.51
  Bottom 1.676: v52.02,69.24 v52.02,62.48
VSS1
  Top 0.381: C6.1 38.02,55.65 IC3.1 42.39,55.65 42.42,55.63 | IC3.25 42.55,51.23 42.72,51.05 42.72,51.89 IC3.25 | 42.42,52.2 IC3.25 | C19.1 104.28,55.55 IC5.1 108.97,55.55
  Top 1.016: C5.1 35.86,56.75 36.58,56.03 37.6,56.03 C6.1 | C19.1 101.86,55.94 C18.1
  Top 1.27: 35.04,56.64 C5.1 | 15.42,61.32 C11.1
  Top 1.676: L3.2 15.42,61.32 15.42,63.17 | C18.1 101.47,56.34 99.77,56.34 99.77,56.39 99.16,56.39 | C5.1 32.77,56.75 32.77,65.79
  Top 1.778: 42.42,55.63 42.42,52.2 | 108.97,55.55 IC5.25
  Top 2.032: 99.16,56.39 99.16,65.79 32.77,65.79 18.03,65.79 15.42,63.17
  pour Top: 41.15,54.36 41.15,57.4 37.85,61.21 46.74,61.21 43.94,57.4 43.94,54.36
  pour Top: 110.49,54.36 110.49,57.4 113.79,61.21 104.14,61.21 107.44,57.4 107.44,54.36

### Text on the board
tPlace: rev1 | IC4 | IC6 | 3V REF | 3V REF | Serial1 | Serial2 | Bpod Analog Output Module | 8-Ch